# Altium schematic sheet MPPT.schdoc: =ProjectName
size A3; Author: Ven
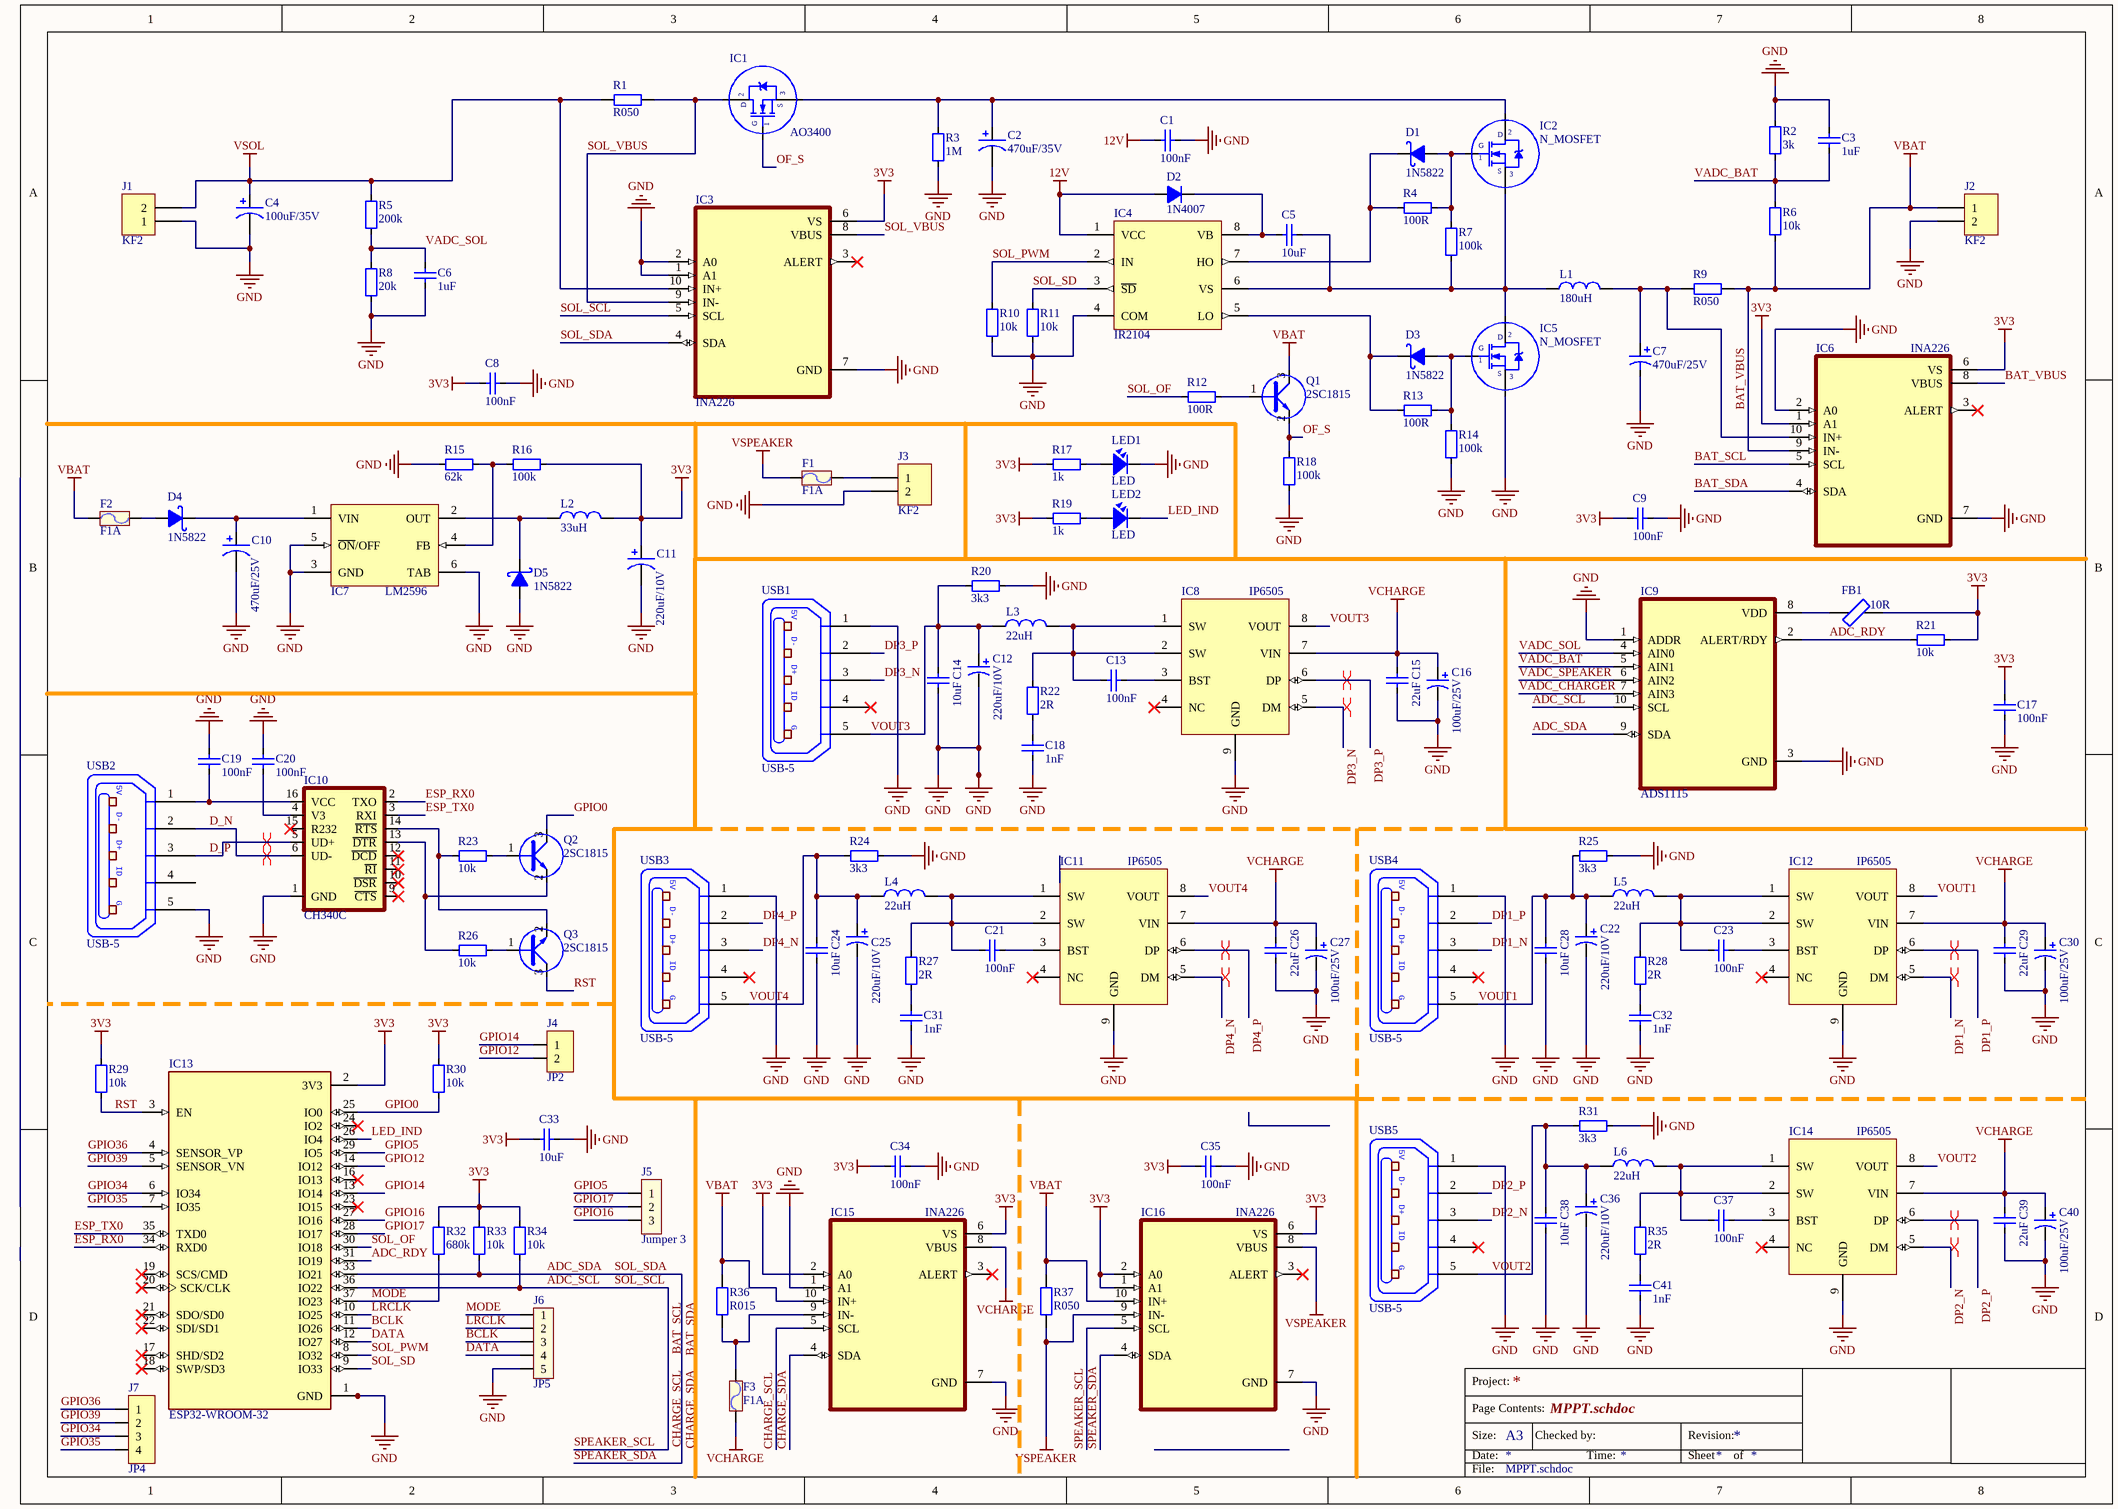
[diagram p0: MPPT.schdoc]

## Parts
C1  100nF  [CAP_0805]
C2  470uF/35V  [CAP_H17_D10]
C3  1uF  [CAP_0805]
C4  100uF/35V  [CAP_H12_D06]
C5  10uF  [CAP_0805]
C6  1uF  [CAP_0805]
C7  470uF/25V  [C8mm]
C8  100nF  [CAP_0805]
C9  100nF  [CAP_0805]
C10  470uF/25V  [C8mm]
C11  220uF/10V  [C5mm]
C12  220uF/10V  [CAP_3216]
C13  100nF  [CAP_0805]
C14  10uF  [CAP_0805]
C15  22uF  [CAP_0805]
C16  100uF/25V  [CAP_3528]
C17  100nF  [CAP_0805]
C18  1nF  [CAP_0805]
C19  100nF  [CAP_0805]
C20  100nF  [CAP_0805]
C21  100nF  [CAP_0805]
C22  220uF/10V  [CAP_3216]
C23  100nF  [CAP_0805]
C24  10uF  [CAP_0805]
C25  220uF/10V  [CAP_3216]
C26  22uF  [CAP_0805]
C27  100uF/25V  [CAP_3528]
C28  10uF  [CAP_0805]
C29  22uF  [CAP_0805]
C30  100uF/25V  [CAP_3528]
C31  1nF  [CAP_0805]
C32  1nF  [CAP_0805]
C33  10uF  [CAP_0805]
C34  100nF  [CAP_0805]
C35  100nF  [CAP_0805]
C36  220uF/10V  [CAP_3216]
C37  100nF  [CAP_0805]
C38  10uF  [CAP_0805]
C39  22uF  [CAP_0805]
C40  100uF/25V  [CAP_3528]
C41  1nF  [CAP_0805]
D1  1N5822  [DIO-214AC(SMA)]
D2  1N4007  [D1A]
D3  1N5822  [DIO-214AC(SMA)]
D4  1N5822  [DIO-214AC(SMA)]
D5  1N5822  [DIO-214AC(SMA)]
F1  F1A  [FUSE2]
F2  F1A  [RES-SMD-1206]
F3  F1A  [RES-1WD]
FB1  10R  [RES-SMD-0805]
IC1  AO3400  [SOT23A]
IC2  N_MOSFET  [TO-220]
IC3  INA226  [VSSOP-10]
IC4  IR2104  [SOP-8]
IC5  N_MOSFET  [TO-220]
IC6  INA226  [VSSOP-10]
IC7  LM2596  [TO263-5]
IC8  IP6505  [ESOP-8]
IC9  ADS1115  [SOP50P490X110-10N]
IC10  CH340C  [SO016]
IC11  IP6505  [ESOP-8]
IC12  IP6505  [ESOP-8]
IC13  ESP32-WROOM-32  [MODULE_ESP32-WROOM-32]
IC14  IP6505  [ESOP-8]
IC15  INA226  [VSSOP-10]
IC16  INA226  [VSSOP-10]
J1  KF2  [KF2-5.08]
J2  KF2  [KF2-5.08]
J3  KF2  [KF2-5.08]
J4  JP2  [JP2-C1T]
J5  Jumper 3  [JP3-C1T]
J6  JP5  [JP5]
J7  JP4  [JP4-C1T]
L1  180uH  [L-DIP-M-13.5x6]
L2  33uH  [L-DIP-M-13.5x6]
L3  22uH  [L-SMD-M-12x10]
L4  22uH  [L-SMD-M-12x10]
L5  22uH  [L-SMD-M-12x10]
L6  22uH  [L-SMD-M-12x10]
LED1  LED  [LED-0805-Red]
LED2  LED  [LED-0805-Red]
Q1  2SC1815  [SOT23D]
Q2  2SC1815  [SOT23D]
Q3  2SC1815  [SOT23D]
R1  R050  [RES-SMD-2512]
R2  3k  [RES-SMD-0805]
R3  1M  [RES-SMD-0805]
R4  100R  [RES-SMD-0805]
R5  200k  [RES-SMD-0805]
R6  10k  [RES-SMD-0805]
R7  100k  [RES-SMD-0805]
R8  20k  [RES-SMD-0805]
R9  R050  [RES-SMD-2512]
R10  10k  [RES-SMD-0805]
R11  10k  [RES-SMD-0805]
R12  100R  [RES-SMD-0805]
R13  100R  [RES-SMD-0805]
R14  100k  [RES-SMD-0805]
R15  62k  [RES-SMD-0805]
R16  100k  [RES-SMD-0805]
R17  1k  [RES-SMD-0805]
R18  100k  [RES-SMD-0805]
R19  1k  [RES-SMD-0805]
R20  3k3  [RES-SMD-0805]
R21  10k  [RES-SMD-0805]
R22  2R  [RES-SMD-0805]
R23  10k  [RES-SMD-0805]
R24  3k3  [RES-SMD-0805]
R25  3k3  [RES-SMD-0805]
R26  10k  [RES-SMD-0805]
R27  2R  [RES-SMD-0805]
R28  2R  [RES-SMD-0805]
R29  10k  [RES-SMD-0805]
R30  10k  [RES-SMD-0805]
R31  3k3  [RES-SMD-0805]
R32  680k  [RES-SMD-0805]
R33  10k  [RES-SMD-0805]
R34  10k  [RES-SMD-0805]
R35  2R  [RES-SMD-0805]
R36  R015  [RES-SMD-2512]
R37  R050  [RES-SMD-2512]
USB1  USB-5  [USB-D2]
USB2  USB-5  [USB-M1]
USB3  USB-5  [USB-D2]
USB4  USB-5  [USB-D2]
USB5  USB-5  [USB-D2]

## Nets
3V3: C8.1 C9.1 C11.1 C17.1 C33.1 C34.1 C35.1 FB1.2 IC3.6(VS) IC6.1(A1) IC6.6(VS) IC13.2(3V3) IC15.2(A0) IC15.6(VS) IC16.1(A1) IC16.2(A0) IC16.6(VS) L2.2 R16.2 R17.2 R19.2 R21.1 R29.2 R30.2 R32.2 R33.2 R34.2
12V: C1.1 D2.1(A) IC4.1(VCC)
BAT_VBUS: F2.1 IC6.8(VBUS) IC6.9(IN-) IC15.10(IN+) IC16.10(IN+) J2.1 Q1.3(C) R6.2 R9.1 R36.1 R37.1  [also labelled VBAT]
GND: C1.2 C2.2 C3.1 C4.2 C6.2 C7.2 C8.2 C9.2 C10.2 C11.2 C12.2 C14.2 C15.2 C16.2 C17.2 C18.1 C19.2 C20.2 C22.2 C24.2 C25.2 C26.2 C27.2 C28.2 C29.2 C30.2 C31.1 C32.1 C33.2 C34.2 C35.2 C36.2 C38.2 C39.2 C40.2 C41.1 D5.1(A) IC3.1(A1) IC3.2(A0) IC3.7(GND) IC4.4(COM) IC5.3(S) IC6.2(A0) IC6.7(GND) IC7.3(GND) IC7.5(~{ON}/OFF) IC7.6(TAB) IC8.9(GND) IC9.1(ADDR) IC9.3(GND) IC10.1(GND) IC11.9(GND) IC12.9(GND) IC13.1(GND) IC13.15(GND) IC13.38(GND) IC13.39_1(GND) IC13.39_2(GND) IC13.39_3(GND) IC13.39_4(GND) IC13.39_5(GND) IC13.39_6(GND) IC13.39_7(GND) IC13.39_8(GND) IC13.39_9(GND) IC13.39_10(GND) IC13.39_11(GND) IC13.39_12(GND) IC13.39_13(GND) IC13.39_14(GND) IC13.39_15(GND) IC13.39_16(GND) IC13.39_17(GND) IC13.39_18(GND) IC13.39_19(GND) IC13.39_20(GND) IC13.39_21(GND) IC14.9(GND) IC15.1(A1) IC15.7(GND) IC16.7(GND) J1.1 J2.2 J3.2 J6.5 LED1.2 R2.1 R3.1 R8.2 R10.1 R11.1 R14.2 R15.2 R18.2 R20.2 R24.2 R25.2 R31.2 USB1.1(P1) USB2.5(P5) USB3.1(P1) USB4.1(P1) USB5.1(P1)
VCHARGE: C15.1 C16.1 C26.1 C27.1 C29.1 C30.1 C39.1 C40.1 F3.1 IC8.7(VIN) IC11.7(VIN) IC12.7(VIN) IC14.7(VIN) IC15.8(VBUS)
VSOL: C4.1 IC3.10(IN+) J1.2 R1.2 R5.2
VSPEAKER: F1.1 IC16.8(VBUS) IC16.9(IN-) R37.2
ADC_RDY: IC9.2(ALERT/RDY) IC13.31(IO19) R21.2
ADC_SCL: IC3.5(SCL) IC6.5(SCL) IC9.10(SCL) IC13.36(IO22) IC15.5(SCL) IC16.5(SCL) R34.1  [also labelled BAT_SCL, CHARGE_SCL, SOL_SCL, SPEAKER_SCL]
ADC_SDA: IC3.4(SDA) IC6.4(SDA) IC9.9(SDA) IC13.33(IO21) IC15.4(SDA) IC16.4(SDA) R33.1  [also labelled BAT_SDA, CHARGE_SDA, SOL_SDA, SPEAKER_SDA]
BCLK: IC13.11(IO26) J6.3
D_N: IC10.6(UD-) USB2.2(P2)
D_P: IC10.5(UD+) USB2.3(P3)
DATA: IC13.12(IO27) J6.4
DP1_N: IC12.5(DM) USB4.3(P3)
DP1_P: IC12.6(DP) USB4.2(P2)
DP2_N: IC14.5(DM) USB5.3(P3)
DP2_P: IC14.6(DP) USB5.2(P2)
DP3_N: IC8.5(DM) USB1.3(P3)
DP3_P: IC8.6(DP) USB1.2(P2)
DP4_N: IC11.5(DM) USB3.3(P3)
DP4_P: IC11.6(DP) USB3.2(P2)
ESP_RX0: IC10.2(TXO) IC13.34(RXD0)
ESP_TX0: IC10.3(RXI) IC13.35(TXD0)
GPIO0: IC13.25(IO0) Q2.3(C) R30.1
GPIO5: IC13.29(IO5) J5.1
GPIO12: IC13.14(IO12) J4.2
GPIO14: IC13.13(IO14) J4.1
GPIO16: IC13.27(IO16) J5.3
GPIO17: IC13.28(IO17) J5.2
GPIO34: IC13.6(IO34) J7.3
GPIO35: IC13.7(IO35) J7.4
GPIO36: IC13.4(SENSOR_VP) J7.1
GPIO39: IC13.5(SENSOR_VN) J7.2
LED_IND: IC13.26(IO4) LED2.2
LRCLK: IC13.10(IO25) J6.2
MODE: IC13.37(IO23) J6.1 R32.1
OF_S: IC1.1(G) Q1.2(E) R18.1
RST: IC13.3(EN) Q3.3(C) R29.1
SOL_OF: IC13.30(IO18) R12.2
SOL_PWM: IC4.2(IN) IC13.8(IO32) R10.2
SOL_SD: IC4.3(~{SD}) IC13.9(IO33) R11.2
SOL_VBUS: IC1.2(D) IC3.8(VBUS) IC3.9(IN-) R1.1
VADC_BAT: C3.2 IC9.5(AIN1) R2.2 R6.1
VADC_CHARGER: IC9.7(AIN3)
VADC_SOL: C6.1 IC9.4(AIN0) R5.1 R8.1
VADC_SPEAKER: IC9.6(AIN2)
VOUT1: C22.1 C28.1 IC12.8(VOUT) L5.1 R25.1 USB4.5(P5)
VOUT2: C36.1 C38.1 IC14.8(VOUT) L6.1 R31.1 USB5.5(P5)
VOUT3: C12.1 C14.1 IC8.8(VOUT) L3.1 R20.1 USB1.5(P5)
VOUT4: C24.1 C25.1 IC11.8(VOUT) L4.1 R24.1 USB3.5(P5)
NetC2_1: C2.1 IC1.3(S) IC2.2(D) R3.2
NetC5_1: C5.1 D2.2(K) IC4.8(VB)
NetC5_2: C5.2 IC2.3(S) IC4.6(VS) IC5.2(D) L1.1 R7.2
NetC7_1: C7.1 IC6.10(IN+) L1.2 R9.2
NetC10_1: C10.1 D4.2(K) IC7.1(VIN)
NetC13_1: C13.1 IC8.1(SW) IC8.2(SW) L3.2 R22.1
NetC13_2: C13.2 IC8.3(BST)
NetC18_2: C18.2 R22.2
NetC19_1: C19.1 IC10.16(VCC) USB2.1(P1)
NetC20_1: C20.1 IC10.4(V3)
NetC21_1: C21.1 IC11.1(SW) IC11.2(SW) L4.2 R27.1
NetC21_2: C21.2 IC11.3(BST)
NetC23_1: C23.1 IC12.1(SW) IC12.2(SW) L5.2 R28.1
NetC23_2: C23.2 IC12.3(BST)
NetC31_2: C31.2 R27.2
NetC32_2: C32.2 R28.2
NetC37_1: C37.1 IC14.1(SW) IC14.2(SW) L6.2 R35.1
NetC37_2: C37.2 IC14.3(BST)
NetC41_2: C41.2 R35.2
NetD1_1: D1.1(A) IC2.1(G) R4.1 R7.1
NetD1_2: D1.2(K) IC4.7(HO) R4.2
NetD3_1: D3.1(A) IC5.1(G) R13.1 R14.1
NetD3_2: D3.2(K) IC4.5(LO) R13.2
NetD4_1: D4.1(A) F2.2
NetD5_2: D5.2(K) IC7.2(OUT) L2.1
NetF1_2: F1.2 J3.1
NetF3_2: F3.2 IC15.9(IN-) R36.2
NetFB1_1: FB1.1 IC9.8(VDD)
NetIC7_4: IC7.4(FB) R15.1 R16.1
NetIC10_13: IC10.13(~{DTR}) Q2.2(E) R26.2
NetIC10_14: IC10.14(~{RTS}) Q3.2(E) R23.2
NetLED1_1: LED1.1 R17.1
NetLED2_1: LED2.1 R19.1
NetQ1_1: Q1.1(B) R12.1
NetQ2_1: Q2.1(B) R23.1
NetQ3_1: Q3.1(B) R26.1

Not connected (* = marked no-connect by the designer): IC3 3(ALERT)*; IC6 3(ALERT)*; IC8 4(NC)*; IC10 9(~{CTS})* 10(~{DSR})* 11(~{RI})* 12(~{DCD})* 15(R232)*; IC11 4(NC)*; IC12 4(NC)*; IC13 16(IO13)* 17(SHD/SD2)* 18(SWP/SD3)* 19(SCS/CMD)* 20(SCK/CLK)* 21(SDO/SD0)* 22(SDI/SD1)* 23(IO15)* 24(IO2)*; IC14 4(NC)*; IC15 3(ALERT)*; IC16 3(ALERT)*; USB1 4(P4)*; USB2 4(P4); USB3 4(P4)*; USB4 4(P4)*; USB5 4(P4)*

## Layout directives
differential pair: D_N, D_P, DP1_N, DP1_P, DP2_N, DP2_P, DP3_N, DP3_P, DP4_N, DP4_P

## Notes on the sheet
- Project:
- Page Contents:
- Size:
- Date:
- A3
- Checked by:
- Time:
- Revision:
- Sheet
- of
- File:
- (in symbol USB-5) 5V; D-; D+; ID; G

## Library data of the parts
C1 C3 C5 C6 C8 C9 C13-C15 C17-C21 C23 C24 C26 C28 C29 C31-C35 C37-C39 C41 = CapSMD: Capacitor; Value: 33p; Published: 8-Jun-2000; LatestRevisionDate: 17-Jul-2002; LatestRevisionNote: Re-released for DXP Platform.; PackageReference: RAD-0.3; Publisher: Altium Limited
C2 C4 C7 C10 C11 = Cap Pol: Polarized Capacitor (Axial); Published: 8-Jun-2000; LatestRevisionDate: 17-Jul-2002; LatestRevisionNote: Re-released for DXP Platform.; PackageReference: POLAR0.8; Publisher: Altium Limited
C12 C16 C22 C25 C27 C30 C36 C40 = CAP_TAN_SMD: Polazied Tantalum Capacitor
D1 D3-D5 = 1N5822: Schottky Rectifiers; Value: Diode c?m 1N5408
D2 = D1A: Diode 1A; Value: 1N4007
F1-F3 = Fuse: Designed by: VanDungEvn; Value: Fuse
FB1 = Ferrit Bead: Generic Ferrit Bead
IC1 IC2 IC5 = MOSFET_N: Generic N Channel MOSFET
IC3 IC6 IC15 IC16 = INA226: Current Sensing IC
IC4 = IR2104: PWM Driver
IC7 = LM2576
IC8 IC11 IC12 IC14 = IP6505: DC/DC Converter Charge IC QC/DCP/...
IC9 = ADS1115: 16 bits 4 channals ADC IC
IC10 = CH340C: USB to serial chip CH340; MF: WCH; Package: Package; Check_prices: https://www.snapeda.com/parts/CH340C/WCH/view-part/5428851/?ref=eda; Value: *; Price: None; MP: CH340C; Availability: Unavailable; SnapEDA_Link: https://www.snapeda.com/parts/CH340C/WCH/view-part/5428851/?ref=snap
IC13 = ESP32-WROOM-32: Bluetooth, WiFi Transceiver Module 2.4GHz ~ 2.5GHz Surface Mount; MF: Espressif Systems; Package: Module Espressif Systems; Digi-Key_Part_Number: 1904-1010-1-ND; Digi-Key_Purchase_URL: https://www.digikey.com/product-detail/en/espressif-systems/ESP32-WROOM-32/1904-1010-1-ND/8544305?utm_source=snapeda&utm_medium=aggregator&utm_campaign=symbol; Value: *; MP: ESP32-WROOM-32; SnapEDA_Link: https://www.snapeda.com/parts/ESP32-WROOM-32/Espressif%20Systems/view-part/2753322/?ref=snap
J1-J3 = KF2: Manufacturer: Würth Elektronik eiSos GmbH; partNo: 691103110002; ComponentLink1 Description: Manufacturer; ComponentLink2 Description: Datasheet; NoPins: 2; Created Date: 29 October 2013; ComponentLink1URL: http://www.we-online.com; ComponentLink2URL: http://katalog.we-online.de/em/datasheet/6911031100xx.pdf; Created by: Karrer Zheng
J4 = JP2: WR-PHD 2.54 mm Angled Socket Header; Manufacturer: W¨¹rth Elektronik eiSos GmbH; partNo: 613002143121; ComponentLink1 Description: Manufacturer; ComponentLink2 Description: Datasheet; NoPins: 02; Created Date: 29 March 2013; ComponentLink1URL: http://www.we-online.com; ComponentLink2URL: http://katalog.we-online.de/em/datasheet/6130xx143121.pdf; Created by: Karrer Zheng
J5 = JP3: Value: J3
J7 = JP4: WR-PHD 2.54 mm Angled Socket Header; Manufacturer: W¨¹rth Elektronik eiSos GmbH; partNo: 613004143121; ComponentLink1 Description: Manufacturer; ComponentLink2 Description: Datasheet; NoPins: 04; Created Date: 29 March 2013; ComponentLink1URL: http://www.we-online.com; ComponentLink2URL: http://katalog.we-online.de/em/datasheet/6130xx143121.pdf; Created by: Karrer Zheng
L1-L6 = Inductor: 180uH 4A 13mm; Value: 150 mH
LED1 LED2 = LED: LED Single colour Green and Red; Value: LED 3 ly Single Colour
Q1-Q3 = C1815: NPN 600mW, ECB; Value: C1815
R1 R9 R36 R37 = Resistor - SMD: Resistor SMD; Manufacturer: Generic Components; Class: Passive; Published: 08/06/2000; Publisher: Altium Hobart Technology Centre
R2-R8 R10-R35 = Resistor - SMD: Resistor; Manufacturer: Generic Components; Class: Passive; Published: 08/06/2000; Publisher: Altium Hobart Technology Centre
USB1-USB5 = USB-5: Manufacturer: FCI; Manufacturer Part Number: 10118193-0001LF; Connector Type: USB - micro B; Number of Contacts: 5; Gender: Receptacle; Specifications: USB 2.0; .Creator: MM; .Checked PCB: RF; Supplier 1: Digi-Key; RoHS: RoHS Compliant; Category: Connectors, Interconnects; Stock 1: 28642; Pricing 1: 1=0.46, 10=0.433, 25=0.3712, 50=0.3156, 100=0.3032, 250=0.27224, 500=0.25988 (USD); Packaging: Cut Tape (CT); Mounting Type: Surface Mount, Right Angle, Horizontal; Features: Shielded, Solder Retention; Ingress Protection: -; ComponentLink1URL: http://portal.fciconnect.com/Comergent//fci/drawing/10118193.pdf; ComponentLink1Description: http://portal.fciconnect.com/Comergent//fci/drawing/10118193.pdf; Supplier Part Number 1: 609-4616-1-ND; .Checked SCH: MM